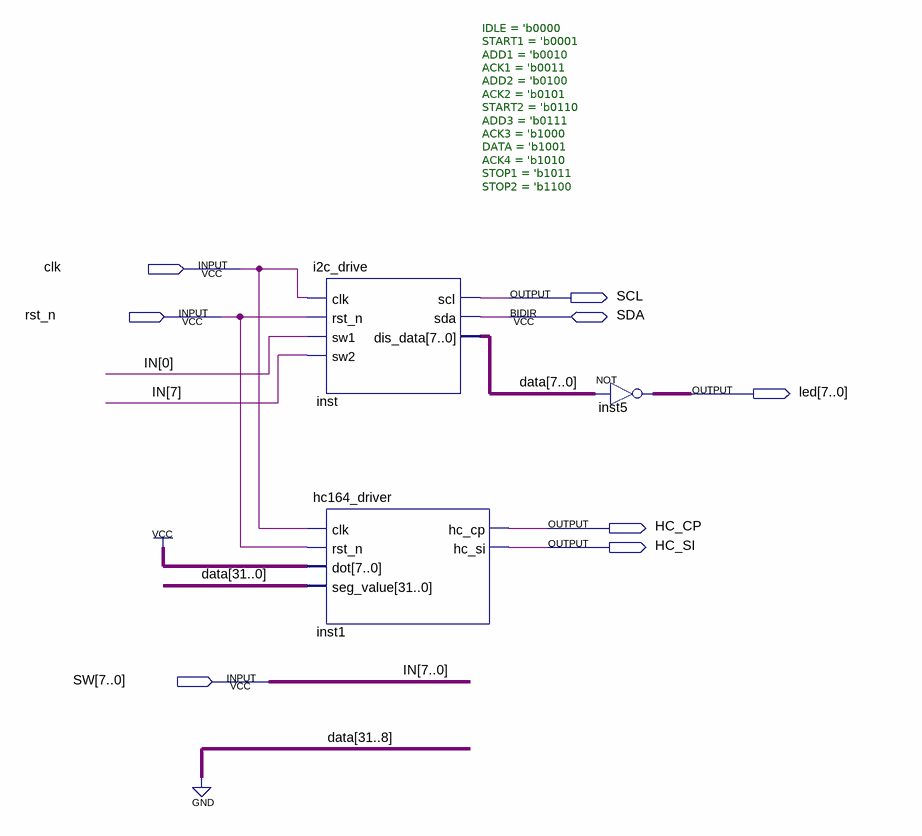
[diagram p0: schematic sheet]
// Quartus schematic i2c_top(1).bdf as structural Verilog: 3 symbols, 8 pins
module \i2c_top(1)  (
  input  clk,
  input  rst_n,
  input  [7:0] SW,
  inout  SDA,
  output SCL,
  output [7:0] led,
  output HC_CP,
  output HC_SI
);

  wire [7:0] data;

  i2c_drive #(.IDLE('b0000), .START1('b0001), .ADD1('b0010), .ACK1('b0011), .ADD2('b0100), .ACK2('b0101), .START2('b0110), .ADD3('b0111), .ACK3('b1000), .DATA('b1001), .ACK4('b1010), .STOP1('b1011), .STOP2('b1100)) inst (
    .clk(clk), .rst_n(rst_n), .sw1(SW[0]), .sw2(SW[7]), .scl(SCL), .dis_data(data), .sda(SDA));
  hc164_driver inst1 (
    .clk(clk), .rst_n(rst_n), .dot({8{1'b1}}), .seg_value({{24{1'b0}}, data}), .hc_cp(HC_CP), .hc_si(HC_SI));
  assign led = ~data;  // NOT inst5, 8 bits wide

  // Other names for the same wires on the sheet: IN[7:0] = SW
endmodule
